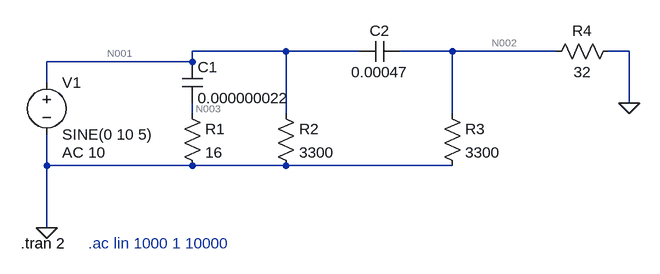
[diagram p0: schematic Draft1.asc]
Draft1.asc, the LTspice schematic file:
Version 4.1
SHEET 1 964 680
WIRE 416 80 272 80
WIRE 528 80 416 80
WIRE 672 80 592 80
WIRE 832 80 672 80
WIRE 944 80 912 80
WIRE 272 96 272 80
WIRE 272 96 48 96
WIRE 48 128 48 96
WIRE 944 160 944 80
WIRE 272 176 272 160
WIRE 416 176 416 80
WIRE 672 176 672 80
WIRE 48 256 48 208
WIRE 272 256 48 256
WIRE 416 256 272 256
WIRE 672 256 416 256
WIRE 48 352 48 256
FLAG 48 352 0
FLAG 944 160 0
SYMBOL voltage 48 112 R0
WINDOW 123 24 124 Left 2
WINDOW 39 0 0 Left 0
SYMATTR InstName V1
SYMATTR Value SINE(0 10 5)
SYMATTR Value2 AC 10
SYMBOL cap 256 96 R0
SYMATTR InstName C1
SYMATTR Value 0.000000022
SYMBOL res 256 160 R0
SYMATTR InstName R1
SYMATTR Value 16
SYMBOL res 400 160 R0
SYMATTR InstName R2
SYMATTR Value 3300
SYMBOL res 656 160 R0
SYMATTR InstName R3
SYMATTR Value 3300
SYMBOL cap 592 64 R90
WINDOW 0 0 32 VBottom 2
WINDOW 3 32 32 VTop 2
SYMATTR InstName C2
SYMATTR Value 0.00047
SYMBOL res 928 64 R90
WINDOW 0 0 56 VBottom 2
WINDOW 3 32 56 VTop 2
SYMATTR InstName R4
SYMATTR Value 32
TEXT 8 376 Left 2 !.tran 2
TEXT 112 376 Left 2 ;.ac lin 1000 1 10000

The netlist it stands for:
* Draft1.asc
V1 N001 0 SINE(0 10 5) AC 10
C1 N001 N003 0.000000022
R1 N003 0 16
R2 N001 0 3300
R3 N002 0 3300
C2 N002 N001 0.00047
R4 0 N002 32
.tran 2
* .ac lin 1000 1 10000
.backanno
.end

* Results of the author's LTspice run, read from the files saved beside the schematic
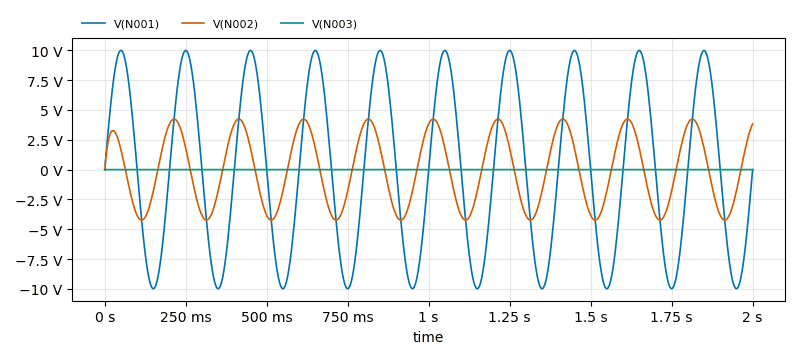
[diagram p1: Transient Analysis of Draft1.asc, plotted from the saved traces]
* Transient Analysis, 1 run:
*   V(N001): min -9.999 V, max 10 V, average 201.4 µV, rms 7.071 V, last 0 V
*   V(N002): min -4.241 V, max 4.239 V, average -28.51 mV, rms 2.97 V, last 3.84 V
*   V(N003): min -110.6 µV, max 110.6 µV, average -985.9 pV, rms 78.22 µV, last 110.6 µV